# Altium schematic sheet 06_POWER-INPUT.SchDoc
size A4; CheckedBy: Inženjer 2; CompanyName: Byte Lab Grupa d.o.o.; Engineer: Matija Puskar; Organization: Byte Lab Grupa d.o.o.; Address1: Medarska 69/1, 10000 Zagreb, Croatia; DocumentNumber: 1; SheetNumber: 6; SheetTotal: 7; Web: www.byte-lab.com; ProjectName: P1X-0XX
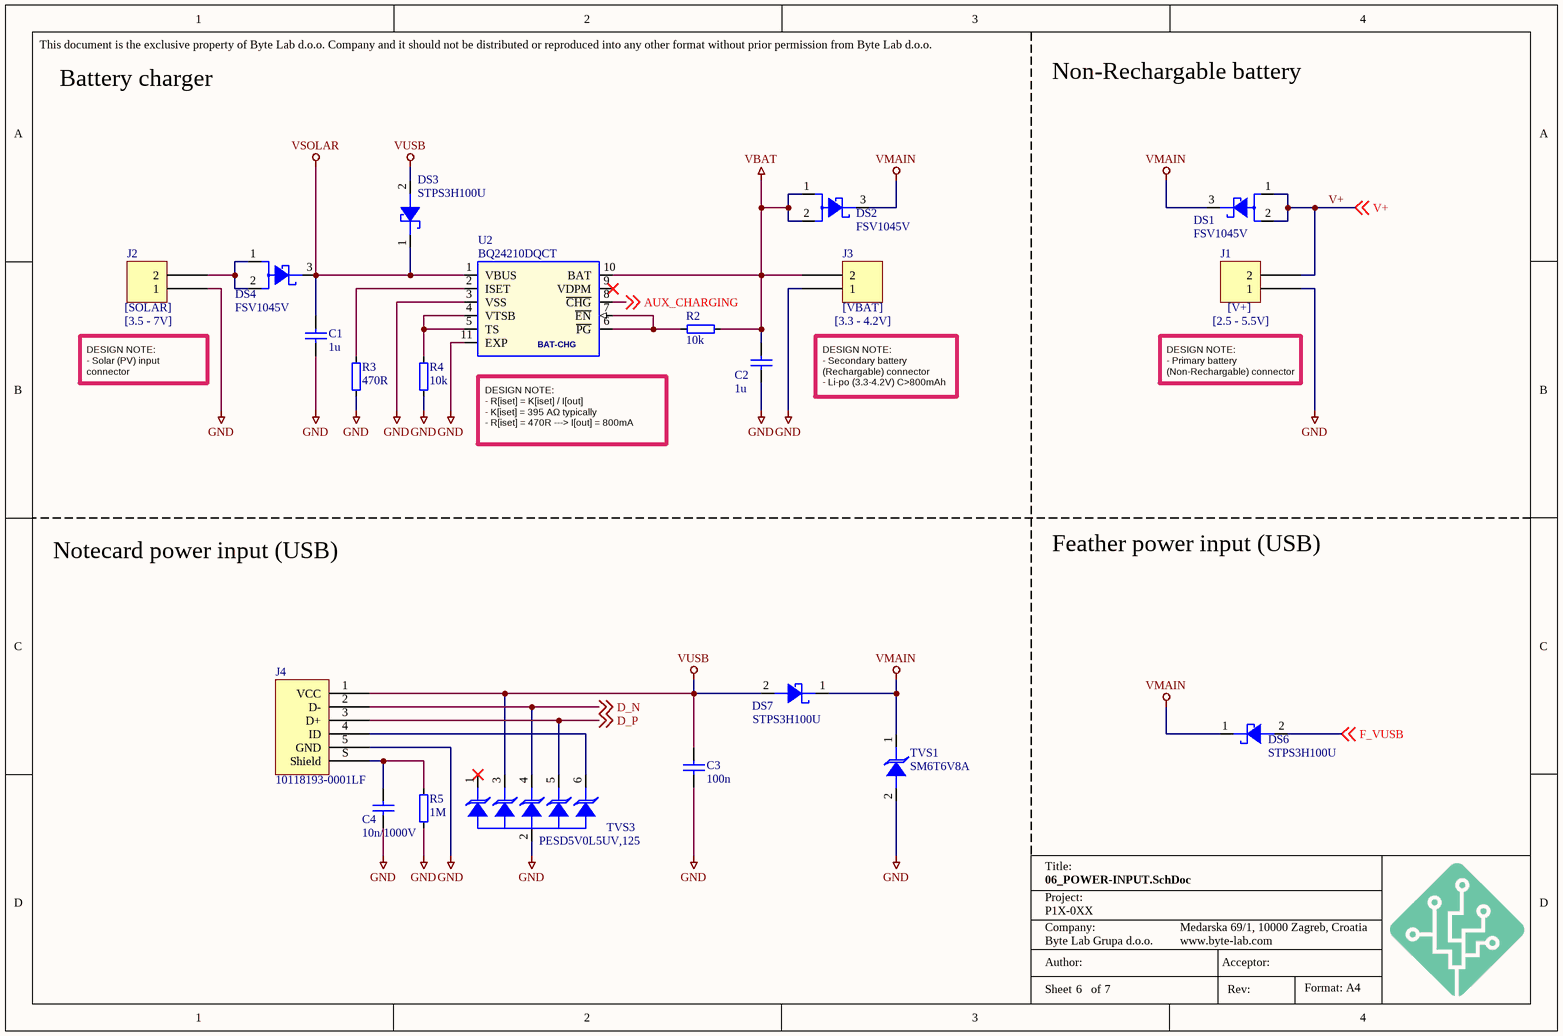
[diagram p0: 06_POWER-INPUT.SchDoc]

## Parts
C1  1u  [C-0603]
C2  1u  [C-0603]
C3  100n  [C-0402]
C4  10n/1000V  [C-1206]
DS1  FSV1045V  [TO277-3]
DS2  FSV1045V  [TO277-3]
DS3  STPS3H100U  [SMB]
DS4  FSV1045V  [TO277-3]
DS6  STPS3H100U  [SMB]
DS7  STPS3H100U  [SMB]
J1  S2BPHSM4TBLFSN  [JST S2B-PH-SM4-TB]  (value not drawn)
J2  S2BPHSM4TBLFSN  [JST S2B-PH-SM4-TB]  (value not drawn)
J3  S2BPHSM4TBLFSN  [JST S2B-PH-SM4-TB]  (value not drawn)
J4  10118193-0001LF  [FCI USB 10118193-0001LF]
R2  10k  [R-0402]
R3  470R  [R-0402]
R4  10k  [R-0402]
R5  1M  [R-1206]
TVS1  SM6T6V8A  [SMB]
TVS3  PESD5V0L5UV,125  [SOT666]
U2  BQ24210DQCT  [WSON10-EXP]

## Nets
GND: C1.1 C2.1 C3.2 C4.2 J1.1 J2.1 J3.1 J4.5(GND) R3.1 R4.1 R5.2 TVS1.2(A) TVS3.2(A2) U2.3(VSS) U2.11(EXP)
VBAT: C2.2 DS2.1(A1) DS2.2(A2) J3.2 R2.2 U2.10(BAT)
VMAIN: DS1.3(C) DS2.3(C) DS6.1(C) DS7.1(C) TVS1.1(C)
VSOLAR: C1.2 DS3.1(C) DS4.3(C) U2.1(VBUS)
VUSB: C3.1 DS3.2(A) DS7.2(A) J4.1(VCC) TVS3.3(C3)
AUX_CHARGING: U2.8(~{CHG}) ; off-sheet AUX_CHARGING
D_N: J4.2(D-) TVS3.4(C4) ; off-sheet D_N
D_P: J4.3(D+) TVS3.5(A5) ; off-sheet D_P
F_VUSB: DS6.2(A) ; off-sheet F_VUSB
V+: DS1.1(A1) DS1.2(A2) J1.2 ; off-sheet V+
NetC4_1: C4.1 J4.S(Shield) R5.1
NetDS4_1: DS4.1(A1) DS4.2(A2) J2.2
NetJ4_4: J4.4(ID) TVS3.6(C6)
NetR2_1: R2.1 U2.6(~{PG}) U2.7(~{EN})
NetR3_2: R3.2 U2.2(ISET)
NetR4_2: R4.2 U2.4(VTSB) U2.5(TS)

Not connected (* = marked no-connect by the designer): TVS3 1(C1)*; U2 9(VDPM)*

## Notes on the sheet
- Battery charger
- Non-Rechargable battery
- (near J2) [SOLAR]
- (near J3) [VBAT]
- (near J1) [V+]
- DESIGN NOTE:
  - Solar (PV) input connector
- (near J2) [3.5 - 7V]
- DESIGN NOTE:
  - Secondary battery (Rechargable) connector
  - Li-po (3.3-4.2V) C>800mAh
- (near J3) [3.3 - 4.2V]
- DESIGN NOTE:
  - Primary battery (Non-Rechargable) connector
- (near J1) [2.5 - 5.5V]
- DESIGN NOTE:
  - R[iset] = K[iset] / I[out]
  - K[iset] = 395 AΩ typically
  - R[iset] = 470R ---> I[out] = 800mA
- Notecard power input (USB)
- Feather power input (USB)
- This document is the exclusive property of Byte Lab d.o.o. Company and it should not be distributed or reproduced into any other format without prior permission from Byte Lab d.o.o.
- Project:
- Title:
- Author:
- Company:
- Acceptor:
- Format: A4
- Sheet
- of
- Rev:
- (in symbol BAT-CHARGE - BQ24210DQCT) BAT-CHG

## Library data of the parts
C1 C2 = C0603-1u-25V-X5R: Capacitor ceramic 1u ±10% X5R 25V; Manufacturer: Yageo; BL Part Number: 2006-223; Manufacturer Part Number: CC0603KRX5R8BB105; Drawn_By: Hamin; Checked_By: Golubic; Supplier 1: Digi-Key; Supplier Part Number 1: 311-1445-1-ND; Note: *; DateModified: 2022-10-07
C3 = C0402-100n-16V-X7R: Capacitor ceramic 100n ±10% X7R 16V 0402; BL Part Number: 2000-908; Drawn_By: Puskar; Checked_By: Dodig; Manufacturer: N/A; Supplier 1: Digi-Key; Supplier Part Number 1: 490-3261-1-ND; Note: *; Manufacturer Part Number: N/A; DateModified: 27-08-2013
C4 = C1206-10n-1000V-X7R - CS1206KKX7RCBB103: Capacitor ceramic 10n ±10% X7R 1000V 1206; Manufacturer: YAGEO; BL Part Number: 2007-449; Drawn_By: Hamin; Supplier 1: Digi-Key; Supplier Part Number 1: 311-3578-1-ND; Note: *; Manufacturer Part Number: CS1206KKX7RCBB103; DateModified: 03-05-2023; Checked_By: *
DS1 DS2 DS4 = SCHOTTKY - FSV1045V - 10A/45V: DIODO SCHOTTKY 10A 45V FSV1045V TO277-3 SMT; BL Part Number: 2007-712; Manufacturer: onsemi; Drawn_By: Blues Wireless; Supplier 1: Digi-Key; Supplier Part Number 1: FSV1045VCT-ND; Manufacturer Part Number: FSV1045V
DS3 DS6 DS7 = SCHOTTKY-STPS3H100U - 3A/100V: DIODO SCHOTTKY 3A 100V STPS3H100U SMB SMT; Manufacturer: STMicroelectronics; BL Part Number: 2007-711; Drawn_By: Blues Wireless; Supplier 1: Digi-Key; Supplier Part Number 1: 497-10392-1-ND; Manufacturer Part Number: STPS3H100U
J1-J3 = S2BPHSM4TBLFSN: PH SMT SIDE ENTRY HDR 2W; Manufacturer: JST; Manufacturer Part Number: S2B-PH-SM4-K-TB (LF)(SN); BL Part Number: 2007-662; Drawn_By: Blues Wireless; Supplier 1: Digi-Key; Supplier Part Number 1: *
J4 = USB 2.0 Type B Micro: CONN RCPT USB2.0 MICRO B SMD R/A; Manufacturer: Amphenol ICC (FCI); BL Part Number: 2007-454; Supplier 1: Digi-Key; Supplier Part Number 1: 609-4616-2-ND; Manufacturer Part Number: 10118193-0001LF
R2 R4 = R0402-10k-1: Resistor 10k ±1% 0402; BL Part Number: 2000-729; Checked_By: Dodig; Drawn_By: Puskar; Supplier 1: Digi-Key; Manufacturer: N/A; Manufacturer Part Number: N/A; Supplier Part Number 1: 311-10.0KLRCT-ND; DateModified: 27-08-2013; Note: *
R3 = R0402-470R-1: Resistor 470R ±1% 0402; BL Part Number: 2001-420; Drawn_By: Hamin; Supplier 1: Digi-Key; Manufacturer: N/A; Manufacturer Part Number: N/A; Supplier Part Number 1: 13-RC0402FR-13470RLCT-ND; DateModified: 10-07-2023; Checked_By: *; Note: *
R5 = R1206-1M-1: Resistor 1M ±1% 1206; BL Part Number: 2001-438; Checked_By: Golubic; Drawn_By: Zvonc; Supplier 1: *; Manufacturer: N/A; Manufacturer Part Number: N/A; Supplier Part Number 1: *; DateModified: 01-07-2014; Note: *
TVS1 = TVS-UNI - SM6T6V8A - 6.8V/600W: DIODO TVS TRANSIL UNIDIR. 600W 6.8V SM6T6V8A SMB SMT; BL Part Number: 2007-453; Manufacturer: STMicroelectronics; Drawn_By: Blues Wireless; Supplier 1: Digi-Key; Supplier Part Number 1: 497-6501-1-ND; Manufacturer Part Number: SM6T6V8A
TVS3 = PESD5V0L5UV,125: PESD Series 25 W 5 V Uni-Directional Fivefold ESD Protection Diode Array SOT-666; Manufacturer: Nexperia; BL Part Number: 2007-452; Drawn_By: Blues Wireless; Supplier 1: Digi-Key; Manufacturer Part Number: PESD5V0L5UV,125; Supplier Part Number 1: 1727-5797-1-ND
U2 = BAT-CHARGE - BQ24210DQCT: INTEGRATO BQ24210DQCT WSON10 TEXAS SMT; BL Part Number: 2005-527; Manufacturer: Texas Instruments; Drawn_By: Blues Wireless; Supplier 1: Digi-Key; Supplier Part Number 1: 296-28738-1-ND; Manufacturer Part Number: BQ24210DQCT